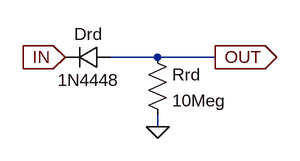
[diagram p0: schematic rd.asc]
rd.asc, the LTspice schematic file:
Version 4
SHEET 1 880 680
WIRE 160 144 96 144
WIRE 240 144 160 144
WIRE 160 240 160 224
FLAG 160 240 0
FLAG 32 144 IN
IOPIN 32 144 In
FLAG 240 144 OUT
IOPIN 240 144 Out
SYMBOL diode 96 160 M270
WINDOW 0 32 32 VTop 0
WINDOW 3 0 32 VBottom 0
SYMATTR InstName Drd
SYMATTR Value 1N4448
SYMBOL res 144 128 R0
SYMATTR InstName Rrd
SYMATTR Value 10Meg

The netlist it stands for:
* rd.asc
Drd OUT IN 1N4448
Rrd OUT 0 10Meg
.model D D
.lib standard.dio
.backanno
.end